# EAGLE design EXT-1P-1 1016 (EAGLE 7.7.0)
COMPANY: ADAFRUIT INDUSTRIES; DRAWN: KTOWN; REV: B
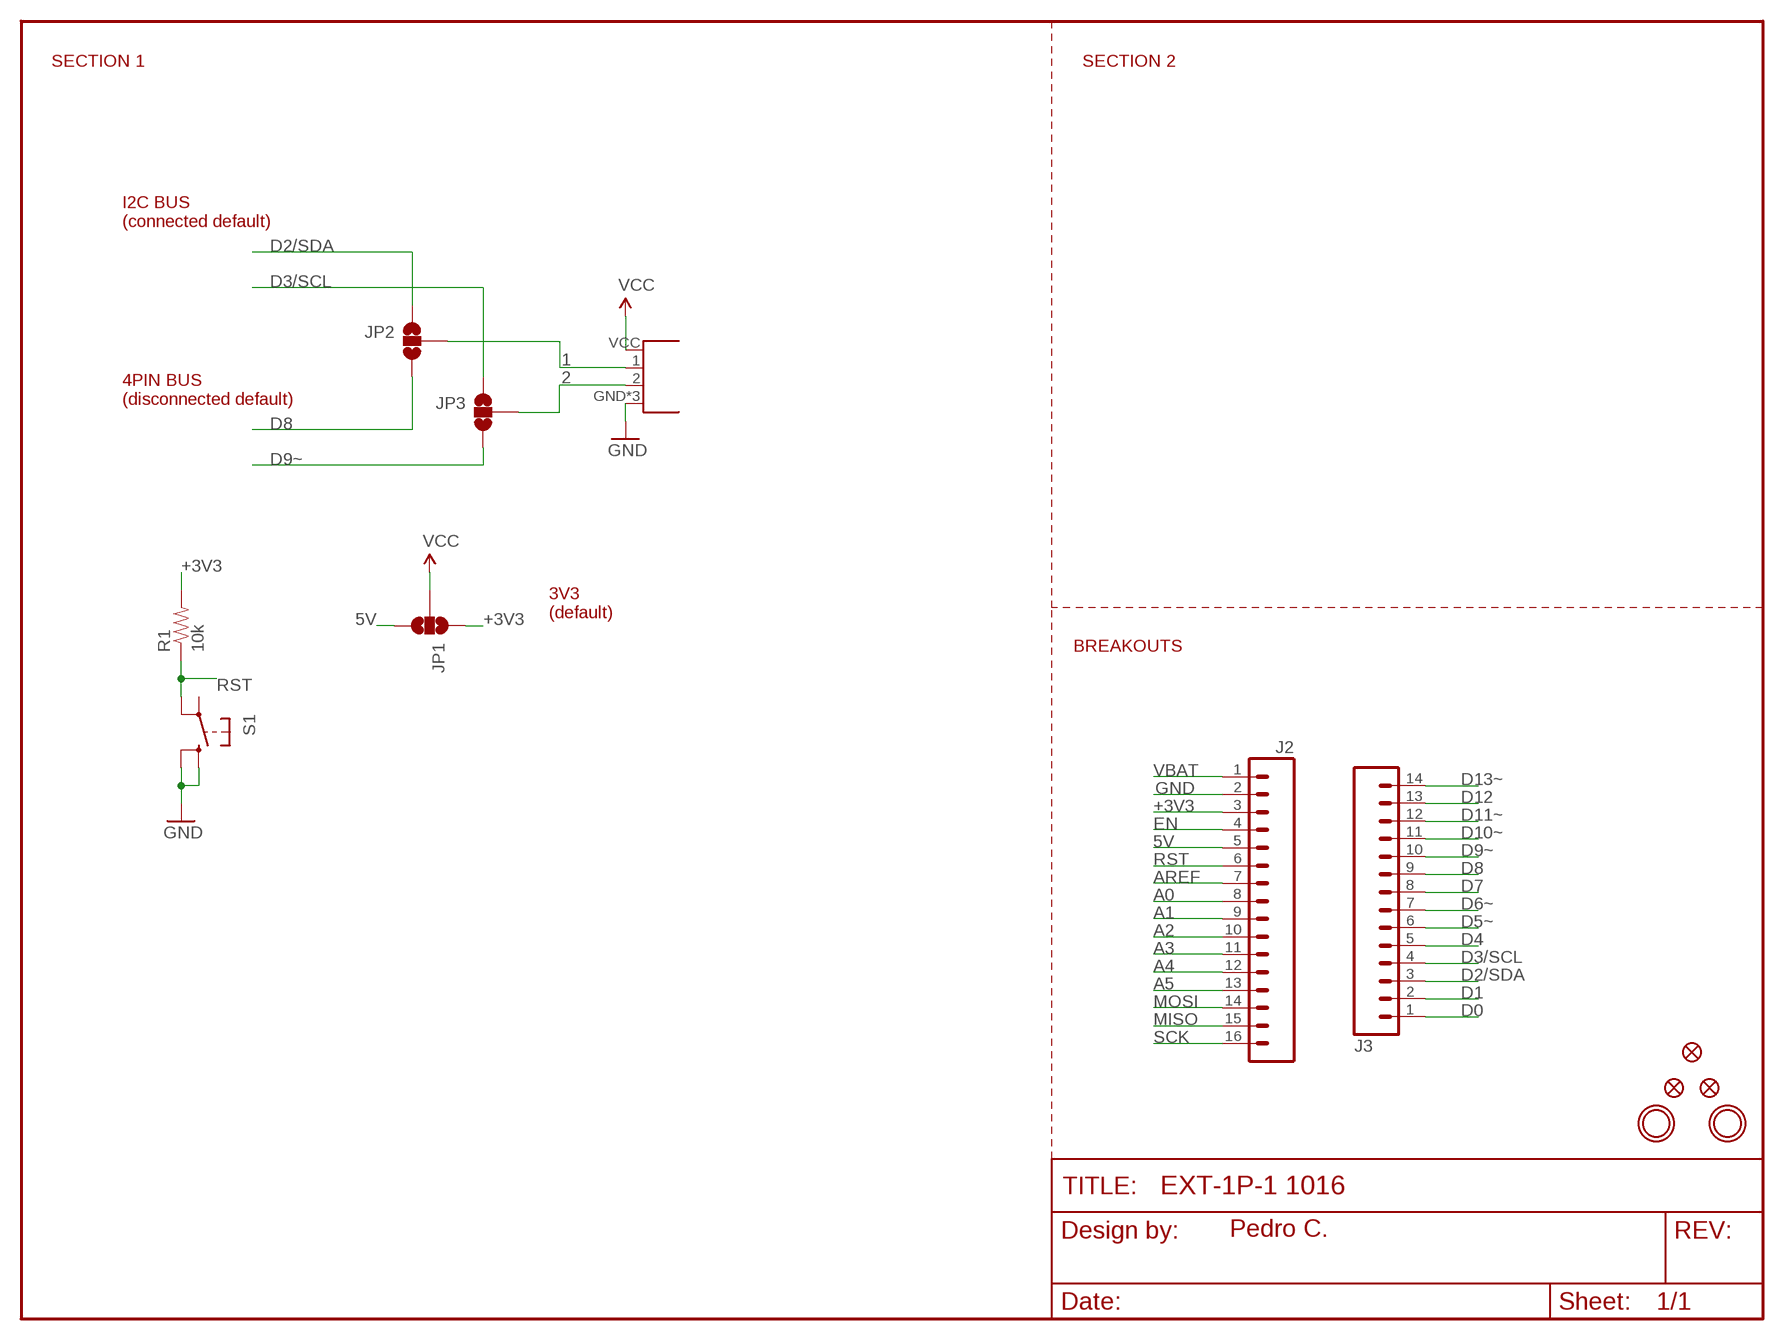
[diagram p0: schematic, sheet 1]

## Parts
FD1  FIDUCIALUFIDUCIAL  [MICRO-FIDUCIAL]
FD2  FIDUCIALUFIDUCIAL  [MICRO-FIDUCIAL]
FD3  FIDUCIALUFIDUCIAL  [MICRO-FIDUCIAL]
J1  USB-A-RECP-SINGLE-SMD  [USB-A-RECP-GNC-SMD]
J2  M16PTH  [1X16]
J3  M14  [1X14]
JP1  SOLDERJUMPER_2WAYPASTE1&2  [SJ_3_PASTE1&2]
JP2  SOLDERJUMPER_2WAYPASTE1&2  [SJ_3_PASTE1&2]
JP3  SOLDERJUMPER_2WAYPASTE1&2  [SJ_3_PASTE1&2]
MP1  MOUNTINGHOLE2.5_THICK  [MOUNTINGHOLE_2.5_PLATED_THICK]
MP2  MOUNTINGHOLE2.5_THICK  [MOUNTINGHOLE_2.5_PLATED_THICK]
R1  10k  RESISTOR0603-RES  [0603-RES]
S1  TACT-SWITCH  [TACT-SWITCH]

## Nets
1: J1.1 JP2.2
2: J1.2 JP3.2
5V: J2.5 JP1.3
+3V3: J2.3 JP1.1 R1.2
A0: J2.8
A1: J2.9
A2: J2.10
A3: J2.11
A4: J2.12
A5: J2.13
AREF: J2.7
D0: J3.1
D1: J3.2
D2/SDA: J3.3 JP2.1
D3/SCL: J3.4 JP3.1
D4: J3.5
D5~: J3.6
D6~: J3.7
D7: J3.8
D8: J3.9 JP2.3
D9~: J3.10 JP3.3
D10~: J3.11
D11~: J3.12
D12: J3.13
D13~: J3.14
EN: J2.4
GND: J1.GND J1.GND1(GND) J1.GND2(GND) J2.2 S1.3 S1.4
MISO: J2.15
MOSI: J2.14
RST: J2.6 R1.1 S1.2
SCK: J2.16
VBAT: J2.1
VCC: J1.VCC JP1.2
Unconnected: S1.1

## Notes on the sheet
- SECTION 1 | SECTION 2
- I2C BUS
  (connected default)
- 4PIN BUS
  (disconnected default)
- 3V3
  (default)
- BREAKOUTS
- Pedro C.

## Library data of the parts
FD1-FD3 = SparkFun-Aesthetics:FIDUCIAL: Fiducial Alignment Points Various fiducial points for machine vision alignment.
J1 = autonomii:USB-A-RECP-SINGLE-SMD
J2 = autonomii:M16: 1x16 .1" header
J3 = autonomii:M14: Header 14 Standard 14-pin 0.1" header. Use with straight break away headers (SKU : PRT-00116), right angle break away headers (PRT-00553), swiss pins (PRT-00743), machine pins (PRT-00117), and female headers (PRT-00115).
JP1-JP3 = autonomii:SOLDERJUMPER_2WAY: Solder Jumper 2 way solder jumper
MP1 MP2 = autonomii:MOUNTINGHOLE: Mounting Hole For #2 screws (0.086"/2.18mm width, 0.094"/2.4mm hole) use 2.5mm
R1 = autonomii:RESISTOR: Resistor Basic schematic elements and footprints for 0603, 1206, and PTH resistors.
S1 = autonomii:TACT-SWITCH: KMR211NGLFS

## Net classes
0 default: clearance 0.254 mm
1 power: width 0.381 mm, clearance 0.254 mm

## Board
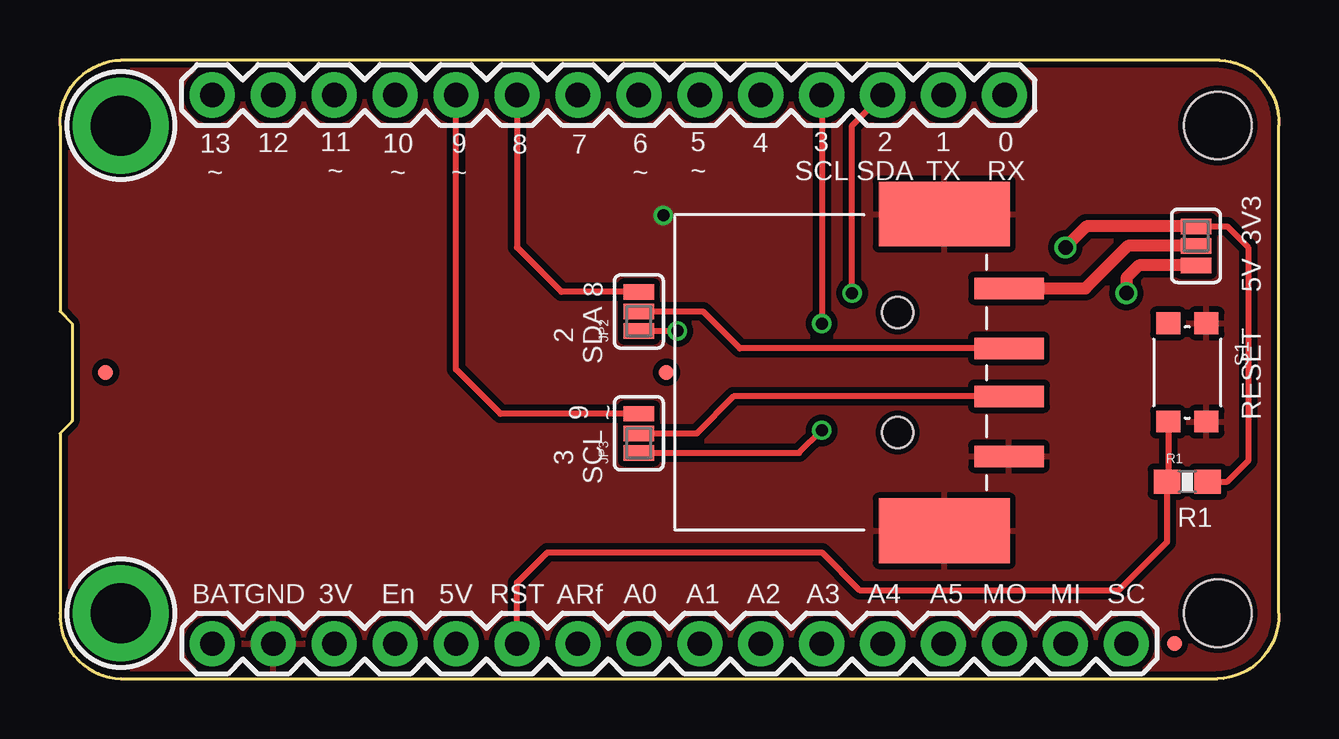
[diagram p1: board, top side]
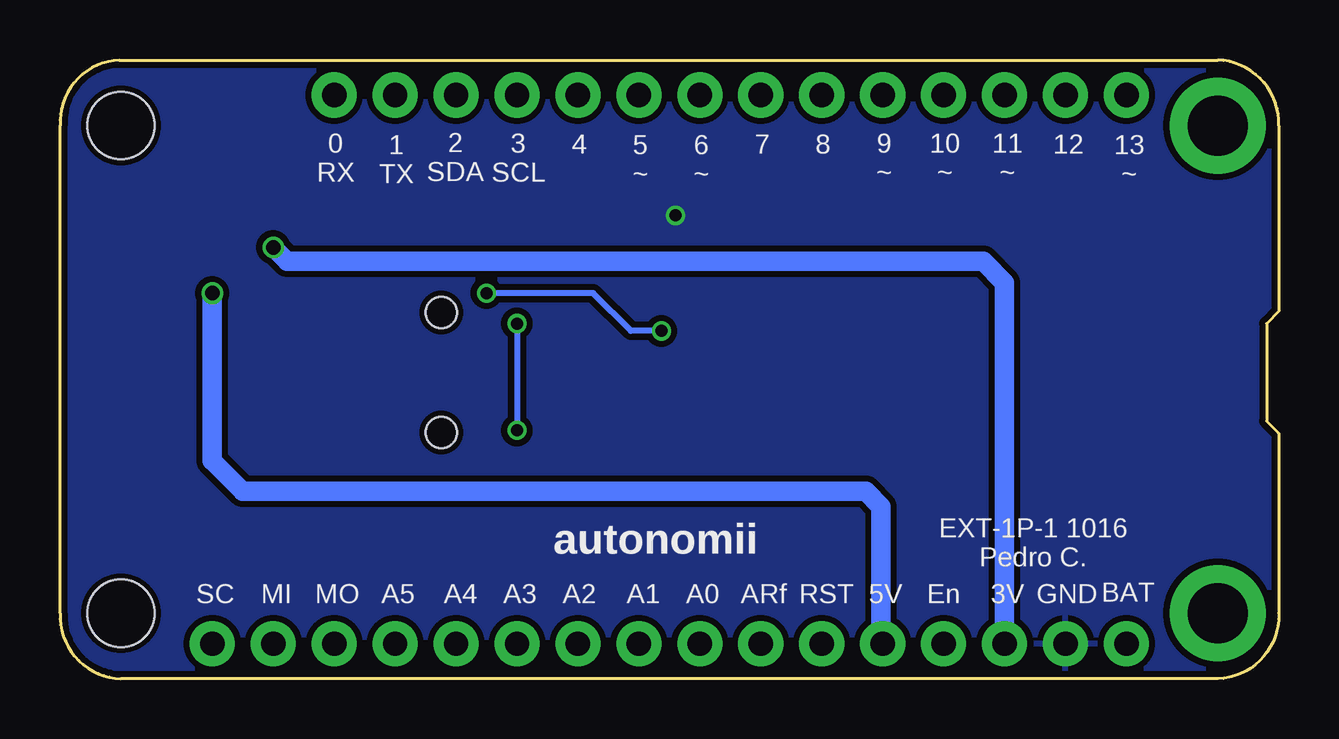
[diagram p2: board, bottom side, seen from below]

Size 50.8 x 25.78 mm. Coordinates in mm from the lower left corner, seen from the top.
Outline: 2.54,0 48.26,0 arc90 50.8,2.73 50.8,23.05 arc90 48.32,25.78 2.54,25.78 arc90 0,23.05 0,15.3 0.51,14.8 0.51,10.73 0,10.22 0,2.73 arc90 2.54,0
Copper layers (1*16): Top 0.035mm / dielectric 1.5mm / Bottom 0.035mm
Design rules "autonomii *": minimum track width 5mil, minimum drill 12mil, track to track 6mil, track to pad 6mil, pad to pad 6mil, via to via 6mil, smd to smd 0mil, copper to edge 10mil, drill to drill 10mil, minimum pad ring 10mil, minimum via ring 6mil, stop-mask expansion 2mil, vias tented up to drill 25mil, thermal gap 10mil
Holes 2.8 mm at 48.26,23.05 48.26,2.73

### Footprints (pad centres in the part's own frame; a part is rotated, then mirrored left to right if it is on the bottom)
MICRO-FIDUCIAL = smd 0.635 x 0.635: 1 0,0
USB-A-RECP-GNC-SMD = smd 2.9 x 0.9: 1 4.65,1; 2 4.655,-1; GND 4.65,-3.5; VCC 4.65,3.5 | smd 5.45 x 2.7: GND1 1.95,6.6; GND2 1.95,-6.6 | hole 1.3: 0,2.5; 0,-2.5
1X16 = drill 1.016 pad 1.88: 1 0,0; 2 2.54,0; 3 5.08,0; 4 7.62,0; 5 10.16,0; 6 12.7,0; 7 15.24,0; 8 17.78,0; 9 20.32,0; 10 22.86,0; 11 25.4,0; 12 27.94,0; 13 30.48,0; 14 33.02,0; 15 35.56,0; 16 38.1,0
1X14 = drill 1.016 pad 1.88: 1 0,0; 2 2.54,0; 3 5.08,0; 4 7.62,0; 5 10.16,0; 6 12.7,0; 7 15.24,0; 8 17.78,0; 9 20.32,0; 10 22.86,0; 11 25.4,0; 12 27.94,0; 13 30.48,0; 14 33.02,0
SJ_3_PASTE1&2 = smd 0.635 x 1.27: 1 -0.813,0; 2 0,0; 3 0.813,0
MOUNTINGHOLE_2.5_PLATED_THICK = drill 2.5 pad 4: P$1 0,0
0603-RES = smd 1.1 x 1: 1 -0.85,0; 2 0.85,0
TACT-SWITCH = smd 0.9 x 1: 1 -2.05,-0.8; 2 2.05,-0.8; 3 -2.05,0.8; 4 2.05,0.8

### Placement (x,y rotation side)
FD1  1.91,12.76 0 top
FD2  25.27,12.76 0 top
FD3  46.46,1.46 0 top
J1  34.91,12.76 0 top
J2  6.35,1.46 0 top
J3  39.37,24.32 180 top
JP1  47.35,18.03 270 top
JP2  24.13,15.3 90 top
JP3  24.13,10.22 90 top
MP1  2.54,23.05 0 top
MP2  2.54,2.73 0 top
R1  46.99,8.21 0 top
S1  46.99,12.76 270 top

### Tracks (layer width: path | path; a pad name or v marks a point on that pad's centre or on a via)
1
  Top 0.254: JP2.2 26.8,15.3 28.34,13.76 J1.1
2
  Top 0.254: JP3.2 26.54,10.22 28.08,11.76 J1.2
5V  (via drill 0.6)
  Top 0.508: JP1.3 44.97,17.22 44.45,16.7 v44.45,16.07
  Bottom 0.813: J2.5 16.57,1.52 16.57,7.18 17.21,7.81 43.18,7.81 44.45,9.08 v44.45,16.07
+3V3  (via drill 0.6)
  Top 0.254: R1.2 48.66,8.21 49.53,9.08 49.53,17.97 48.65,18.85 JP1.1
  Top 0.508: JP1.1 42.79,18.85 v41.91,17.97
  Bottom 0.813: J2.3 11.43,16.51 12.32,17.4 41.34,17.4 v41.91,17.97
D2/SDA  (via drill 0.5)
  Top 0.254: J3.3 33.02,23.05 v33.02,16.07 | JP2.1 v25.73,14.49
  Bottom 0.254: v25.73,14.49 27,14.49 28.57,16.07 v33.02,16.07
D3/SCL  (via drill 0.5)
  Top 0.254: J3.4 v31.75,14.8 | JP3.1 30.81,9.41 v31.75,10.35
  Bottom 0.254: v31.75,14.8 v31.75,10.35
D8
  Top 0.254: J3.9 19.05,17.97 20.9,16.12 JP2.3
D9~
  Top 0.254: J3.10 16.51,12.89 18.36,11.04 JP3.3
GND  (via drill 0.5)
  other vias: 25.15,19.3
  pour Top: -0.76,26.35 -0.76,-0.44 51.5,-0.44 51.69,26.23
  pour Bottom: -0.51,-0.06 51.18,-0.13 51.31,25.91 -0.38,25.97
RST
  Top 0.254: J2.6 19.05,4 20.32,5.27 31.75,5.27 33.33,3.69 44.14,3.69 46.14,5.69 R1.1 46.19,8.26 S1.2
VCC
  Top 0.508: J1.VCC 42.74,16.26 44.51,18.03 JP1.2

### Text on the board
tPlace: 13 / ~ | 12 | 11 / ~ | 10 / ~ | 9 / ~ | 8 | 7 | 6 / ~ | 5 / ~ | 4 | 3 / SCL | 2 / SDA | 1 / TX | 0 / RX | 3V3 | 5V | 8 | 2 / SDA | RESET | 9 / ~ | 3 / SCL | R1 | BAT | GND | 3V | En | 5V | RST | ARf | A0 | A1 | A2 | A3 | A4 | A5 | MO | MI | SC
bPlace: 12 | 11 / ~ | 10 / ~ | 9 / ~ | 8 | 7 | 4 | 3 / SCL | 2 / SDA | 0 / RX | 13 / ~ | 6 / ~ | 5 / ~ | 1 / TX | autonomii | EXT-1P-1 1016 / Pedro C. | BAT | GND | 3V | En | 5V | RST | ARf | A0 | A1 | A2 | A3 | A4 | A5 | MO | MI | SC